# EAGLE design Pinduino-Nano-Sys11a-AR (EAGLE 9.0.1)
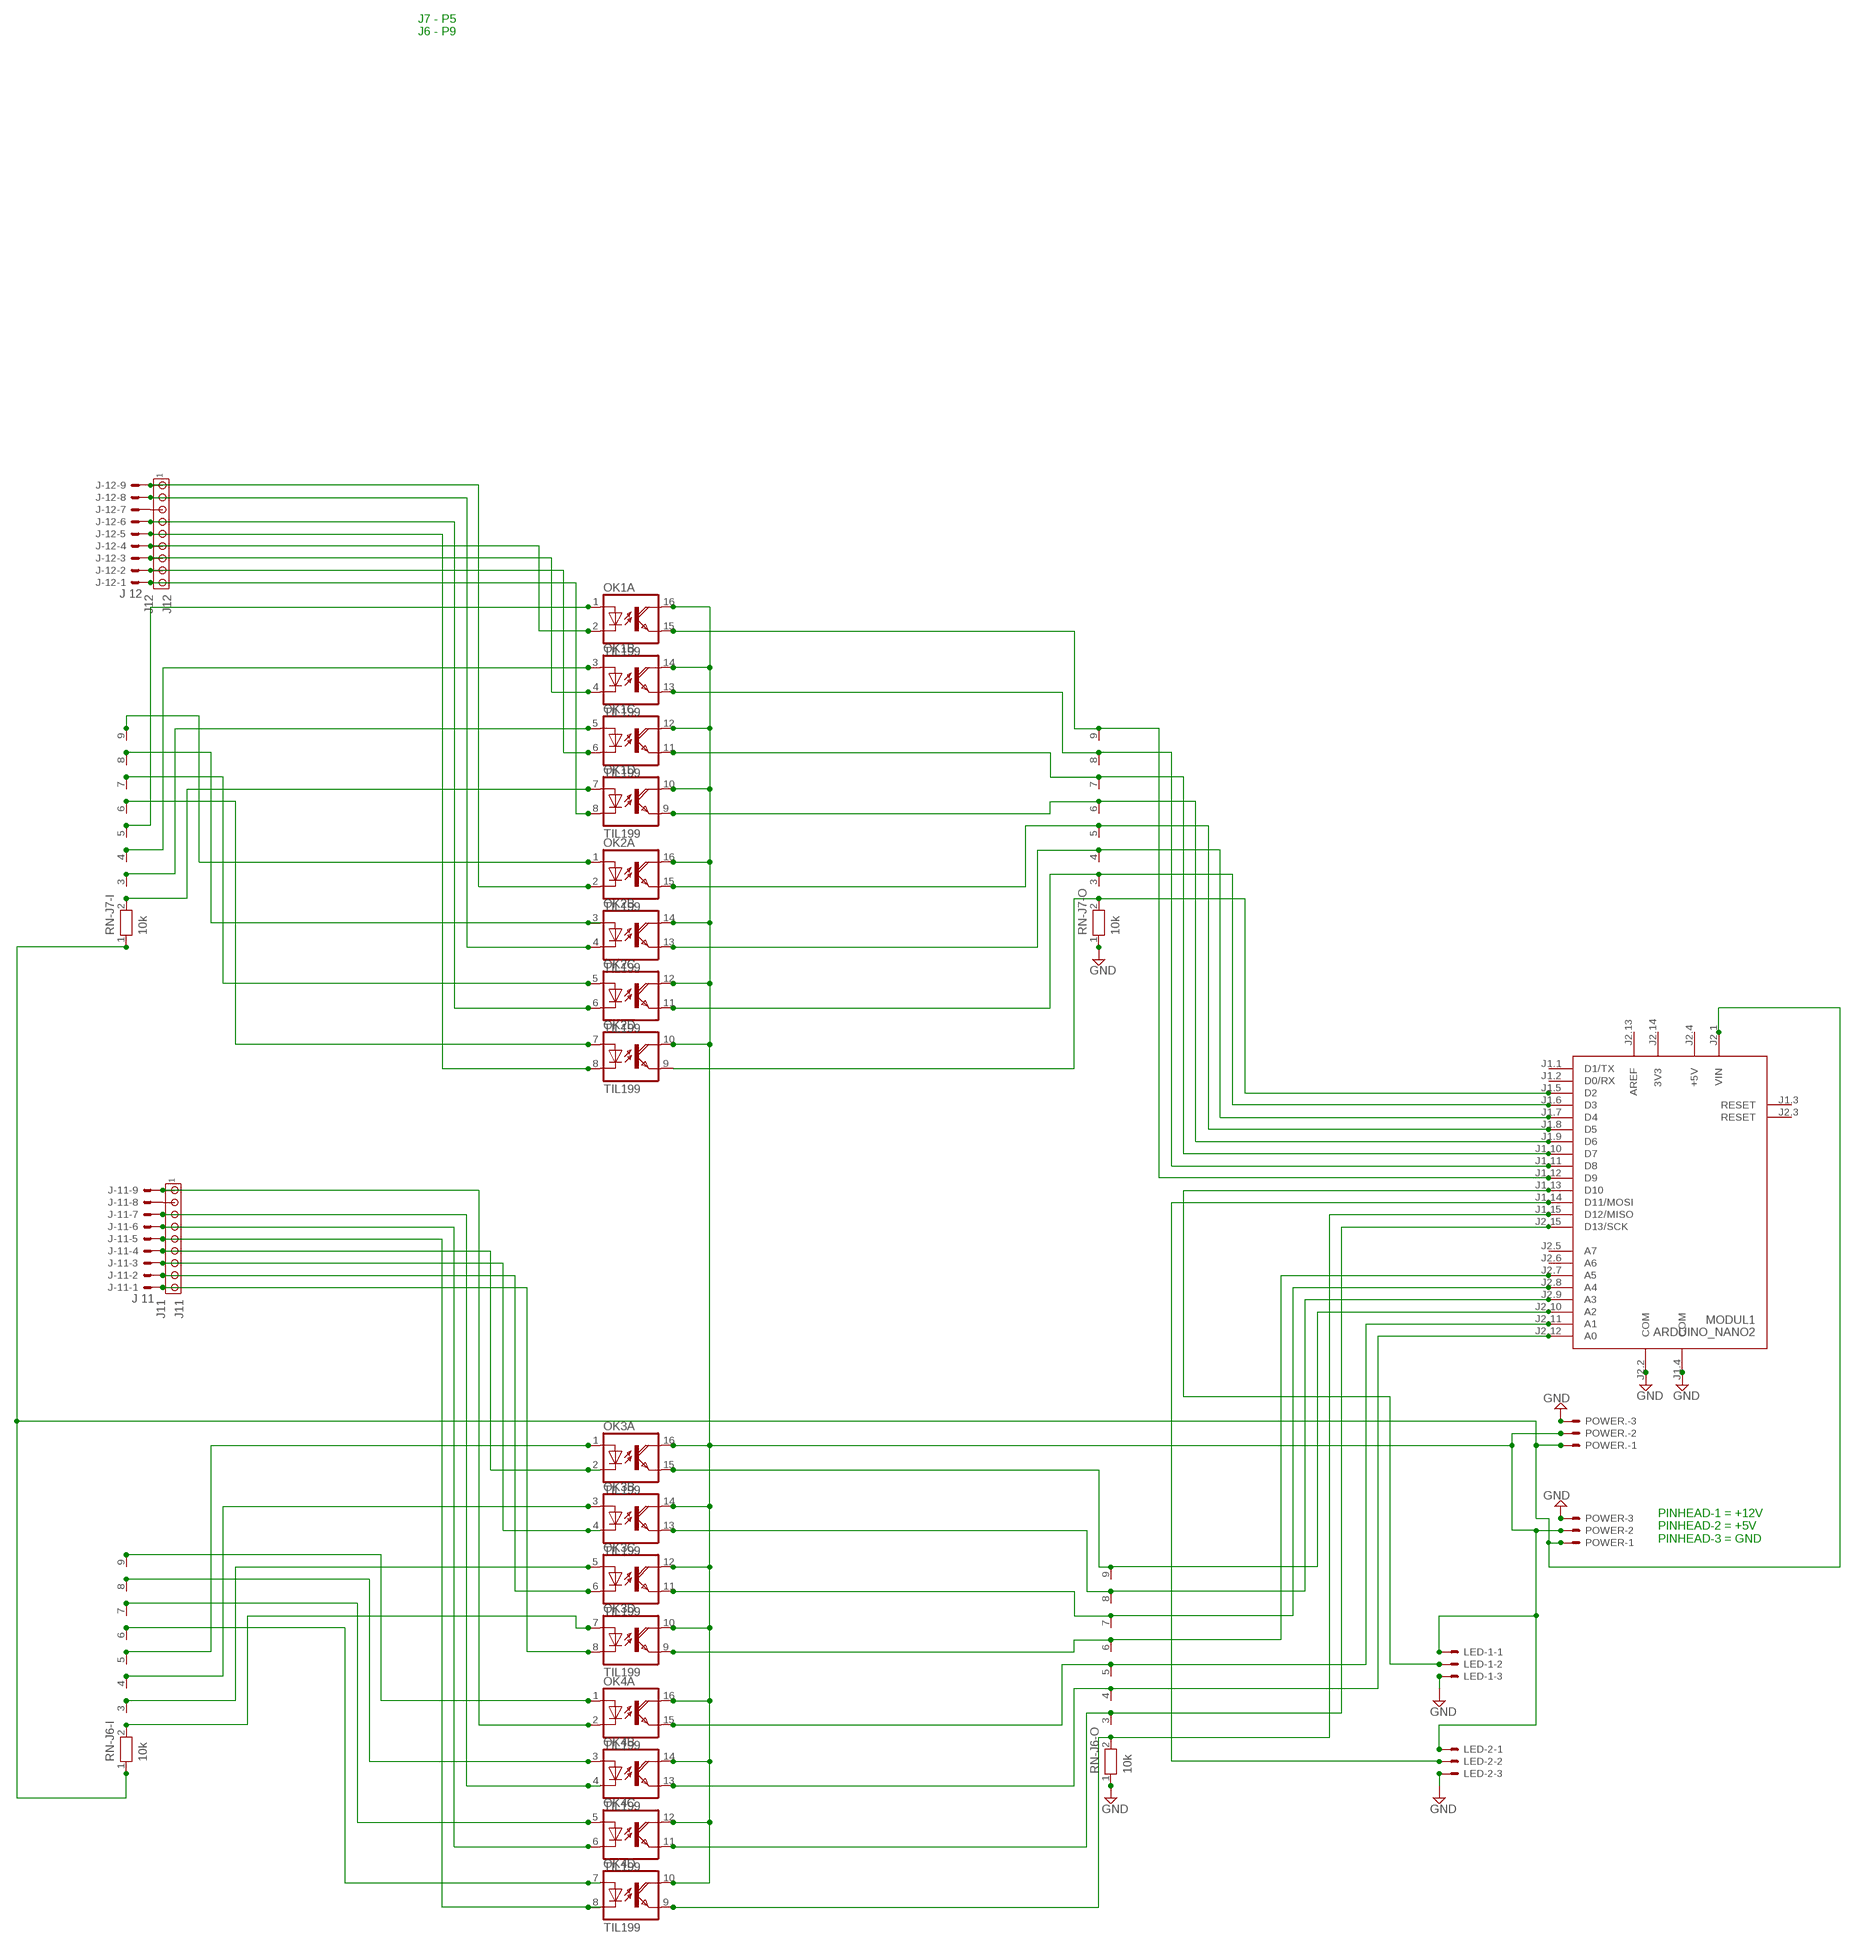
[diagram p0: schematic, sheet 1]

## Parts
J11  J11  MTA09-156  [1X9MTA]
J12  J12  MTA09-156  [1X9MTA]
J-11  J 11  KK-156-9  [KK-156-9]
J-12  J 12  KK-156-9  [KK-156-9]
LED-1  22-23-2031  [22-23-2031]
LED-2  22-23-2031  [22-23-2031]
MODUL1  ARDUINO_NANO2  [ARDUINO_NANO2]
OK1  TIL199  [DIL16]
OK2  TIL199  [DIL16]
OK3  TIL199  [DIL16]
OK4  TIL199  [DIL16]
POWER  22-23-2031  [22-23-2031]
POWER.  22-23-2031  [22-23-2031]
RN-J6-I  10k  RN08  [RN-9]
RN-J6-O  10k  RN08  [RN-9]
RN-J7-I  10k  RN08  [RN-9]
RN-J7-O  10k  RN08  [RN-9]

## Nets
ARD+5V [Power]: LED-1.1 LED-2.1 OK1.10(D:COL) OK1.12(C:COL) OK1.14(B:COL) OK1.16(A:COL) OK2.10(D:COL) OK2.12(C:COL) OK2.14(B:COL) OK2.16(A:COL) OK3.10(D:COL) OK3.12(C:COL) OK3.14(B:COL) OK3.16(A:COL) OK4.10(D:COL) OK4.12(C:COL) OK4.14(B:COL) OK4.16(A:COL) POWER.2 POWER..2
GND: LED-1.3 LED-2.3 MODUL1.J1.4(COM) MODUL1.J2.2(COM) POWER.3 POWER..3 RN-J6-O.1 RN-J7-O.1
N$1: J12.6 J-12.4 OK1.2(A:C)
N$2: MODUL1.J1.5(D2) OK2.9(D:EMI) RN-J7-O.2
N$3: OK1.3(B:A) RN-J7-I.4
N$4: OK1.5(C:A) RN-J7-I.3
N$5: OK1.7(D:A) RN-J7-I.2
N$6: OK2.1(A:A) RN-J7-I.9
N$7: OK2.3(B:A) RN-J7-I.8
N$8: OK2.5(C:A) RN-J7-I.7
N$9: OK1.1(A:A) RN-J7-I.5
N$10: J12.9 J-12.1 OK1.8(D:C)
N$11: J12.8 J-12.2 OK1.6(C:C)
N$12: J12.7 J-12.3 OK1.4(B:C)
N$13: OK2.7(D:A) RN-J7-I.6
N$14: J12.5 J-12.5 OK2.8(D:C)
N$15: J11.9 J-11.1 OK3.8(D:C)
N$16: J12.2 J-12.8 OK2.4(B:C)
N$17: J12.1 J-12.9 OK2.2(A:C)
N$18: MODUL1.J1.6(D3) OK2.11(C:EMI) RN-J7-O.3
N$19: J11.7 J-11.3 OK3.4(B:C)
N$20: J11.5 J-11.5 OK4.8(D:C)
N$21: J11.4 J-11.6 OK4.6(C:C)
N$22: J11.3 J-11.7 OK4.4(B:C)
N$23: J12.3 J-12.7
N$24: MODUL1.J1.11(D8) OK1.13(B:EMI) RN-J7-O.8
N$25: J11.2 J-11.8
N$27: J11.1 J-11.9 OK4.2(A:C)
N$28: MODUL1.J1.7(D4) OK2.13(B:EMI) RN-J7-O.4
N$29: OK4.1(A:A) RN-J6-I.9
N$30: OK4.3(B:A) RN-J6-I.8
N$31: OK4.5(C:A) RN-J6-I.7
N$32: OK3.3(B:A) RN-J6-I.4
N$33: OK3.1(A:A) RN-J6-I.5
N$34: OK3.5(C:A) RN-J6-I.3
N$35: OK4.7(D:A) RN-J6-I.6
N$36: MODUL1.J2.8(A4) OK3.11(C:EMI) RN-J6-O.7
N$37: OK3.7(D:A) RN-J6-I.2
N$38: MODUL1.J2.7(A5) OK3.9(D:EMI) RN-J6-O.6
N$39: MODUL1.J2.15(D13/SCK) OK4.11(C:EMI) RN-J6-O.3
N$40: J11.8 J-11.2 OK3.6(C:C)
N$42: MODUL1.J2.12(A0) OK4.13(B:EMI) RN-J6-O.4
N$43: MODUL1.J2.11(A1) OK4.15(A:EMI) RN-J6-O.5
N$44: LED-2.2 MODUL1.J1.14(D11/MOSI)
N$45: LED-1.2 MODUL1.J1.13(D10)
N$46: MODUL1.J1.12(D9) OK1.15(A:EMI) RN-J7-O.9
N$47: J12.4 J-12.6 OK2.6(C:C)
N$48: J11.6 J-11.4 OK3.2(A:C)
N$49: MODUL1.J1.10(D7) OK1.11(C:EMI) RN-J7-O.7
N$51: MODUL1.J1.8(D5) OK2.15(A:EMI) RN-J7-O.5
N$54: MODUL1.J1.9(D6) OK1.9(D:EMI) RN-J7-O.6
N$55: MODUL1.J2.9(A3) OK3.13(B:EMI) RN-J6-O.8
N$56: MODUL1.J2.10(A2) OK3.15(A:EMI) RN-J6-O.9
N$60: MODUL1.J1.15(D12/MISO) OK4.9(D:EMI) RN-J6-O.2
N$61 [GND]: MODUL1.J2.1(VIN) POWER.1 POWER..1 RN-J6-I.1 RN-J7-I.1
Unconnected: MODUL1.J1.1(D1/TX) MODUL1.J1.2(D0/RX) MODUL1.J1.3(RESET) MODUL1.J2.3(RESET) MODUL1.J2.5(A7) MODUL1.J2.6(A6)

## Notes on the sheet
- J7 - P5
  J6 - P9
- PINHEAD-1 = +12V
  PINHEAD-2 = +5V
  PINHEAD-3 = GND

## Power pins joined to a net without a drawn wire
3V3: MODUL1.J2.14(3V3)
+5V: MODUL1.J2.4(+5V)
AREF: MODUL1.J2.13(AREF)

## Library data of the parts
J11 J12 = con-amp:MTA09-156: AMP connector
J-11 J-12 = con-molex:KK-156-9: KK 156 HEADER Source: http://www.molex.com/pdm_docs/sd/026604100_sd.pdf; OC_FARNELL: unknown; OC_NEWARK: unknown
LED-1 LED-2 POWER POWER. = con-molex:22-23-2031: .100" (2.54mm) Center Header - 3 Pin; MF: MOLEX; MPN: 22-23-2031; OC_FARNELL: 1462950; OC_NEWARK: 30C0862
MODUL1 = arduino:ARDUINO_NANO2: Arduino Nano2 Auto generated by modulcreator.ulp \;; ANZAHL: 2; MODUL: TRUE; STECKX0: -76200; STECKX1: 76200; STECKY0: 177800; STECKY1: 177800
OK1-OK4 = optocoupler:TIL199: TEXAS INSTRUMENTS OPTO COUPLER; MPN: TIL 199; OC_FARNELL: 1683370; OC_NEWARK: 05R6483
RN-J6-I RN-J6-O RN-J7-I RN-J7-O = resistor-net:RN08: RESISTOR NETWORK; OC_FARNELL: unknown; OC_NEWARK: unknown

## Net classes
0 default: width 0.406 mm
1 Power: width 0.61 mm
2 GND: width 0.61 mm

## Board
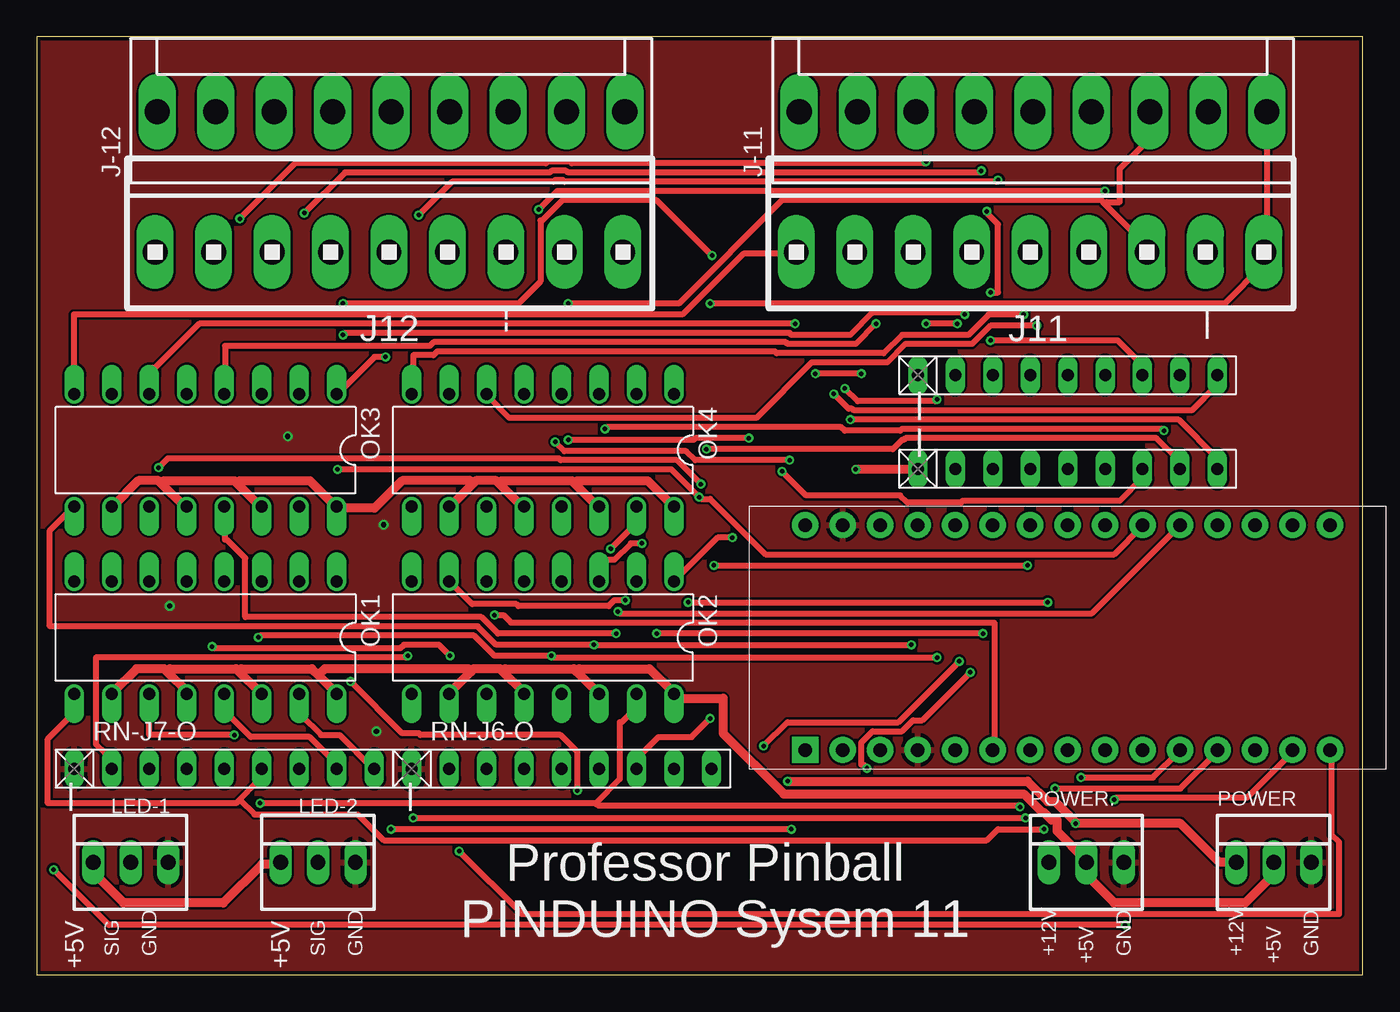
[diagram p1: board, top side]
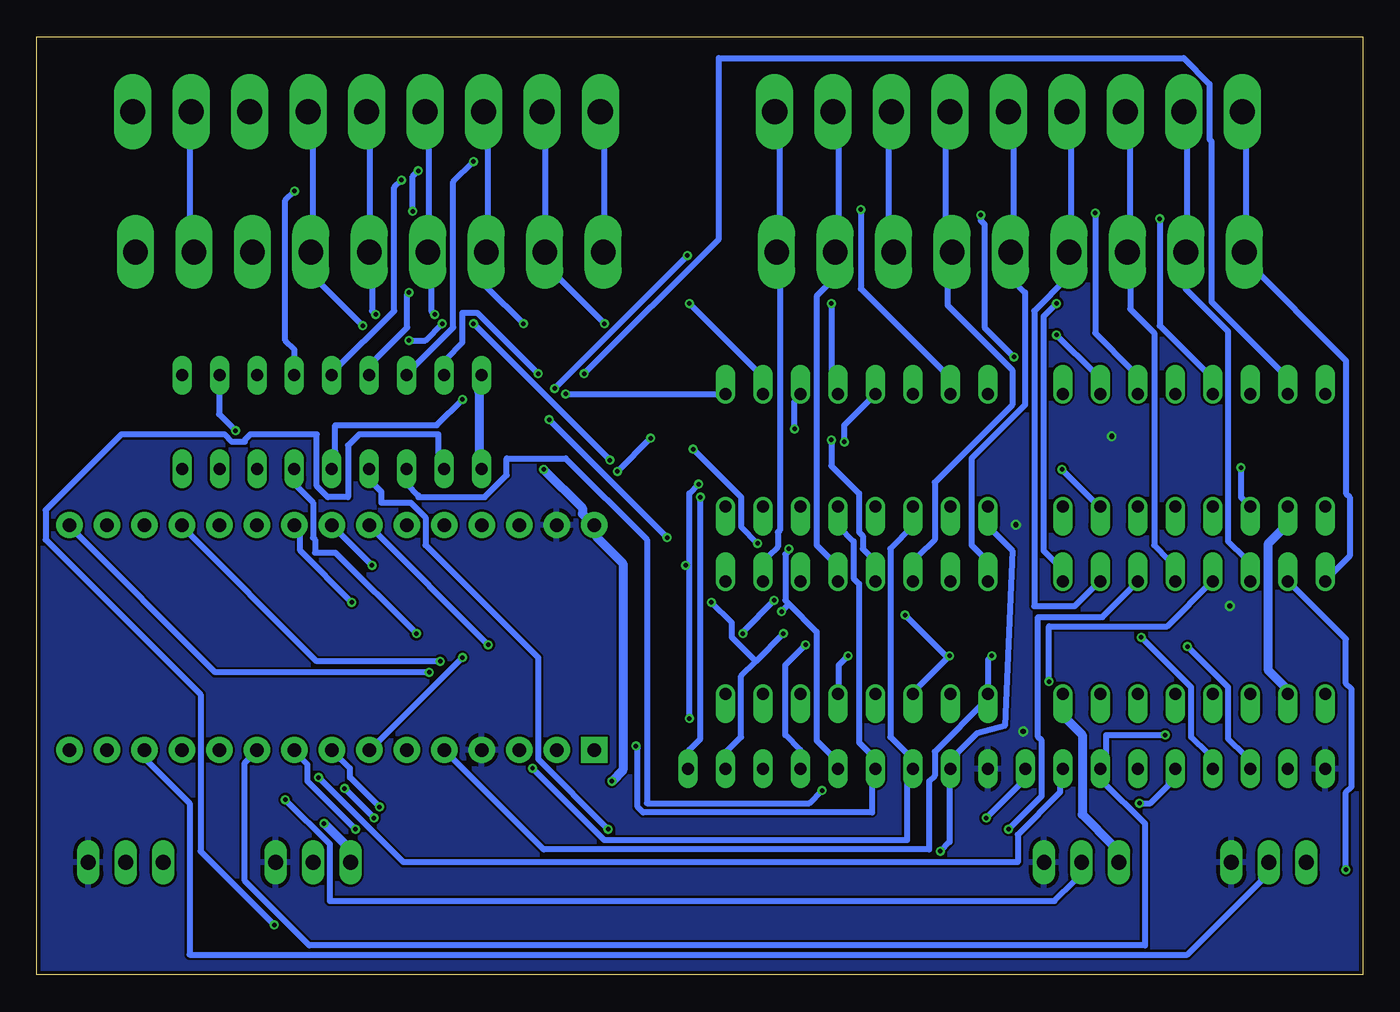
[diagram p2: board, bottom side, seen from below]

Size 89.84 x 63.57 mm. Coordinates in mm from the lower left corner, seen from the top.
Outline: 0,0 89.84,0 89.84,63.57 0,63.57 0,0
Copper layers (1*16): Top 0.035mm / dielectric 1.5mm / Bottom 0.035mm
Design rules "SeeedStudio_2layer_DRU_no_angle_20140221": minimum track width 6mil, minimum drill 12mil, track to track 6mil, track to pad 6mil, pad to pad 6mil, via to via 6mil, smd to smd 0mil, copper to edge 10mil, drill to drill 10mil, minimum pad ring 10mil, minimum via ring 6mil, stop-mask expansion 2mil, vias tented up to drill 100mil, thermal gap 10mil

### Footprints (pad centres in the part's own frame; a part is rotated, then mirrored left to right if it is on the bottom)
1X9MTA = drill 1.676 long: 1 15.85,0; 2 11.887,0; 3 7.925,0; 4 3.962,0; 5 0,0; 6 -3.962,0; 7 -7.925,0; 8 -11.887,0; 9 -15.85,0
KK-156-9 = drill 1.7 pad 2.184 long: 1 -15.84,0; 2 -11.88,0; 3 -7.92,0; 4 -3.96,0; 5 0,0; 6 3.96,0; 7 7.92,0; 8 11.88,0; 9 15.84,0
22-23-2031 = drill 1 long: 1 -2.54,0; 2 0,0; 3 2.54,0
ARDUINO_NANO2 = drill 0.914 pad 1.778 square: J1.1 -7.62,17.78 | drill 0.914 pad 1.778: J1.2 -7.62,15.24; J1.3 -7.62,12.7; J1.4 -7.62,10.16; J1.5 -7.62,7.62; J1.6 -7.62,5.08; J1.7 -7.62,2.54; J1.8 -7.62,0; J1.9 -7.62,-2.54; J1.10 -7.62,-5.08; J1.11 -7.62,-7.62; J1.12 -7.62,-10.16; J1.13 -7.62,-12.7; J1.14 -7.62,-15.24; J1.15 -7.62,-17.78; J2.1 7.62,17.78; J2.2 7.62,15.24; J2.3 7.62,12.7; J2.4 7.62,10.16; J2.5 7.62,7.62; J2.6 7.62,5.08; J2.7 7.62,2.54; J2.8 7.62,0; J2.9 7.62,-2.54; J2.10 7.62,-5.08; J2.11 7.62,-7.62; J2.12 7.62,-10.16; J2.13 7.62,-12.7; J2.14 7.62,-15.24; J2.15 7.62,-17.78
DIL16 = drill 0.813 offset: 1 -8.89,-3.81; 2 -6.35,-3.81; 3 -3.81,-3.81; 4 -1.27,-3.81; 5 1.27,-3.81; 6 3.81,-3.81; 7 6.35,-3.81; 8 8.89,-3.81; 9 8.89,3.81; 10 6.35,3.81; 11 3.81,3.81; 12 1.27,3.81; 13 -1.27,3.81; 14 -3.81,3.81; 15 -6.35,3.81; 16 -8.89,3.81
RN-9 = drill 0.813 long: 1 -10.16,0; 2 -7.62,0; 3 -5.08,0; 4 -2.54,0; 5 0,0; 6 2.54,0; 7 5.08,0; 8 7.62,0; 9 10.16,0

### Placement (x,y rotation side)
J11  67.31,48.99 0 top
J12  23.86,48.99 0 top
J-11  67.5,58.5 0 top
J-12  24,58.5 0 top
LED-1  6.35,7.62 0 top
LED-2  19.05,7.62 0 top
MODUL1  69.85,22.86 90 top
OK1  11.43,22.86 180 top
OK2  34.29,22.86 180 top
OK3  11.43,35.56 180 top
OK4  34.29,35.56 180 top
POWER  83.82,7.62 0 top
POWER.  71.12,7.62 0 top
RN-J6-I  69.85,40.64 0 top
RN-J6-O  35.56,13.97 0 top
RN-J7-I  69.85,34.29 0 top
RN-J7-O  12.7,13.97 0 top

### Tracks (layer width: path | path; a pad name or v marks a point on that pad's centre or on a via)
ARD+5V
  Top 0.61: 8.44,33.31 10,31.75 OK3.12 | 8.44,33.31 8.25,33.5 6.88,33.5 5.12,31.75 OK3.10 | 13.56,33.31 13.38,33.5 8.62,33.5 8.44,33.31 | 13.56,33.31 15.12,31.75 OK3.14 | 13.56,33.31 13.75,33.5 18.5,33.5 20.25,31.75 OK3.16 20.5,31.62 22.88,31.62 24.75,33.5 29.38,33.5 29.56,33.31 | 29.56,33.31 29.75,33.5 31.12,33.5 31.31,33.31 | 29.56,33.31 28,31.75 OK4.10 | 31.31,33.31 32.88,31.75 OK4.12 | 36.44,33.31 36.25,33.5 31.5,33.5 31.31,33.31 | 36.44,33.31 38,31.75 OK4.14 | OK4.16 43.12,31.75 41.38,33.5 36.62,33.5 36.44,33.31 | LED-1.1 3.88,7.5 3.88,6.5 4.25,6.5 5.88,4.88 12.62,4.88 15.25,7.5 16.5,7.5 LED-2.1 | 8.81,20.56 10.25,19.12 OK1.12 | 8.81,20.56 8.62,20.75 6.75,20.75 5.12,19.12 OK1.10 | 13.69,20.56 13.5,20.75 9,20.75 8.81,20.56 | 13.69,20.56 15.12,19.12 OK1.14 | 19.06,20.31 18.62,20.75 13.88,20.75 13.69,20.56 | 19.06,20.31 20.25,19.12 OK1.16 | POWER.2 83.75,7.5 83.75,6.75 81.88,4.88 73,4.88 71.38,6.5 71.12,6.5 71.12,7.5 POWER..2 71,7.88 69.12,9.75 69.12,10.5 68.75,10.5 68.25,11 68.12,11 66.88,12.25 50.62,12.25 46.5,16.38 46.5,18.75 43.25,18.75 OK2.16 43.12,19.12 41.5,20.75 36.75,20.75 36.56,20.56 | 29.44,20.56 29.62,20.75 31.38,20.75 31.56,20.56 | 29.44,20.56 28,19.12 OK2.10 | 31.56,20.56 33,19.12 OK2.12 | 36.56,20.56 36.38,20.75 31.75,20.75 31.56,20.56 | 36.56,20.56 38,19.12 OK2.14 | 19.06,20.31 19.5,20.75 29.25,20.75 29.44,20.56
  Bottom 0.61: LED-2.1 16.62,7.62 16.88,7.88 16.88,8.75 19,10.88 19,16.25 20.25,17.5 20.25,19 OK1.16 | OK3.10 5.12,31.75 5.38,31.5 5.38,30.25 6.38,29.25 6.38,20.62 5.12,19.38 5.12,19.12 OK1.10
GND  (via drill 0.35)
  other vias: 23,16.5 23.5,30.5 17,36.5 9,25
  pour Top: -1.27,64.77 -1.27,-2.54 92.71,-2.54 92.71,64.77
  pour Bottom: -2.54,66.04 -2.54,-1.27 91.44,-1.27 91.44,66.04
N$1
  Bottom 0.406: OK1.2 17.88,26.62 19.5,25 22.25,25 22.25,45 20,47.25 20,48.88 J12.6 19.75,49.12 19.75,58.25 20,58.5 J-12.4
N$2  (via drill 0.3)
  Top 0.406: v25.12,21.62 25,21.5 4,21.5 4,15.62 4.62,15 5,15 5,14 RN-J7-O.2
  Bottom 0.406: v25.12,21.62 25.38,21.38 25.38,19.12 OK2.9 25.5,18.88 25.5,18.62 29,15.12 29,13.5 29.38,13.12 29.38,8.5 55.5,8.5 62.12,15.12 MODUL1.J1.5
N$3  (via drill 0.3)
  Top 0.406: v51.12,9.88 v24,9.88
  Bottom 0.406: v24,9.88 21.75,12.12 21.75,15.88 22,16.12 22,24.25 17.62,24.25 15.25,26.62 OK1.3 | v51.12,9.88 55.88,14.62 55.88,21.5 63.5,29.12 63.5,31 64.5,32 66.5,32 66.5,32.75 67.25,33.5 67.25,34.25 RN-J7-I.4
N$4  (via drill 0.3)
  Top 0.406: v21.25,19.88 24.75,16.38 25.88,16.38 26,16.25 35.5,16.25 36.62,15.12 v36.62,12.5
  Bottom 0.406: v21.25,19.88 21.25,23.62 13.25,23.62 10.25,26.62 OK1.5 | v36.62,12.5 37.5,11.62 48.5,11.62 48.5,29.5 54,35 58,35 58,33.88 59.5,32.38 64,32.38 64,32.5 64.75,33.25 64.75,34.25 RN-J7-I.3
N$5  (via drill 0.3)
  Top 0.406: v1.12,7.12 4.88,3.38 v73.75,3.38
  Bottom 0.406: v1.12,7.12 1.12,12.38 0.75,12.75 0.75,19.38 1.12,19.75 1.12,22.75 5,26.62 OK1.7 | v73.75,3.38 78.75,8.38 78.75,19 89.25,29.5 89.25,31.5 84.12,36.62 77.12,36.62 76.62,36.12 75.75,36.12 75.75,36.25 75.38,36.62 70.88,36.62 70.88,33.12 70.12,32.38 68.75,32.38 68.75,35.88 68,36.62 62.62,36.62 62.62,35.38 62.25,35 62.25,34.38 RN-J7-I.2
N$6  (via drill 0.3)
  Top 0.406: v47.12,29.62 46.12,29.62 43.25,26.75 OK2.1 | v55.12,37.62 77.38,37.62 80,35 80,34.38 RN-J7-I.9
  Bottom 0.406: v55.12,37.62 v47.12,29.62
N$7  (via drill 0.3)
  Top 0.406: v41,29.25 40.25,29.25 39.12,28.12 38.12,28.12 38.12,26.75 OK2.3 | v45.38,35.62 58,35.62 58.62,36.25 58.75,36.25 58.88,36.38 75.88,36.38 77.38,34.88 77.38,34.38 RN-J7-I.8
  Bottom 0.406: v41,29.25 42.12,30.38 42.12,32.38 v45.38,35.62
N$8  (via drill 0.3)
  Top 0.406: v36,36.25 44.5,36.25 44.62,36.38 v48.25,36.38 | v50.5,34.12 52.12,32.5 58.5,32.5 59,32 62.62,32 62.75,32.12 73.38,32.12 74.88,33.62 74.88,34.25 RN-J7-I.7
  Bottom 0.406: v36,36.25 36,34.5 34.12,32.62 34.12,30 33.88,29.75 33.88,28.88 33.38,28.38 33.38,27 33.12,26.75 OK2.5 | v50.5,34.12 v48.25,36.38
N$9  (via drill 0.3)
  Top 0.406: v20.75,45.5 32.62,45.5 34.12,47 34.12,51.12 34.25,51.12 35.62,52.5 42,52.5 v45.75,48.75 | v54.75,39.75 55.62,38.88 60.88,38.88 v61,39
  Bottom 0.406: v20.75,45.5 21.62,44.62 21.62,28.75 20.75,27.88 20.75,27.12 20.38,26.75 OK1.1 | v54.75,39.75 v45.75,48.75 | v61,39 62.75,37.25 69.62,37.25 69.62,35.5 69.75,35.38 69.75,34.38 RN-J7-I.5
N$10
  Bottom 0.406: OK1.8 2.5,26.75 0.88,28.38 0.88,32.38 1.12,32.62 1.12,41.62 8,48.5 8,48.88 J12.9 7.88,49.12 7.88,58.25 8.12,58.5 J-12.1
N$11
  Bottom 0.406: OK1.6 7.62,26.75 8,27.12 8,28.25 9.12,29.38 9.12,43.62 12,46.5 12,48.88 J12.8 11.88,49.12 11.88,58.38 12,58.5 J-12.2
N$12
  Bottom 0.406: OK1.4 12.75,26.75 13.12,27.12 13.12,28.12 14.12,29.12 14.12,43.5 15.75,45.12 15.75,48.75 15.88,48.88 J12.7 15.75,49 15.75,58.25 16,58.5 J-12.3
N$13  (via drill 0.3)
  Top 0.406: v39.88,25.38 39.12,25.38 38.75,25 32.62,25 32.5,25.12 29.5,25.12 28,26.62 OK2.7 | v64.12,23.12 v42,23.12
  Bottom 0.406: v39.88,25.38 42,23.25 v42,23.12 | v64.12,23.12 69.62,28.62 71,28.62 71,29.5 71.12,29.62 71.12,32 72.38,33.25 72.38,34.25 RN-J7-I.6
N$14
  Bottom 0.406: OK2.8 25.5,26.75 25.75,27 25.75,28.38 26.5,29.12 26.5,35 22.88,38.62 22.88,46.25 23.75,47.12 23.75,48.88 J12.5 23.62,49 23.62,58.12 J-12.5
N$15
  Top 0.406: OK3.8 2.5,39.38 2.5,44.75 43.75,44.75 47.88,48.88 51.38,48.88 J11.9
  Bottom 0.406: J-11.1 51.62,58.5 51.38,58.25 51.38,49 J11.9
N$16
  Bottom 0.406: OK2.4 35.62,26.75 36,27.12 36,28.12 37,29.12 37,46 35.75,47.25 35.75,48.88 J12.2 35.62,49.12 35.5,49.25 35.5,58.12 J-12.8
N$17
  Bottom 0.406: OK2.2 40.62,26.75 40.25,27.12 40.25,28.38 39.62,29 39.62,30 39.5,30.12 39.5,48.75 39.62,48.88 J12.1 39.5,49 39.5,58.25 39.75,58.5 J-12.9
N$18  (via drill 0.3)
  Top 0.406: v11.88,22.25 12,22.12 24.62,22.12 24.88,22.38 27.25,22.38 v28,21.62 | v31,24.38 31.62,24.38 32.12,23.88 64.88,23.88 64.88,15.25 MODUL1.J1.6
  Bottom 0.406: v11.88,22.25 9.12,19.5 9.12,16 8,14.88 8,14.38 7.62,14 RN-J7-O.3 | OK2.11 30.38,19.12 30.38,19.25 v28,21.62 28.25,21.62 v31,24.38
N$19  (via drill 0.3)
  Top 0.406: v56.88,44.12 55.5,42.75 50.88,42.75 50.75,42.88 26.88,42.88 26.62,42.62 12.75,42.62 12.75,39.38 OK3.4
  Bottom 0.406: v56.88,44.12 59.38,46.62 59.38,48.88 J11.7 59.25,49.12 59.25,58.25 59.5,58.5 J-11.3
N$20  (via drill 0.3)
  Top 0.406: v66.88,44.75 64.5,44.75 63.12,43.38 58.62,43.38 57.38,42.12 50.12,42.12 50,42.25 27.12,42.25 26.88,42 25.5,42 25.5,39.38 OK4.8
  Bottom 0.406: v66.88,44.75 67.12,45 67.12,48.75 67.25,48.88 J11.5 67.25,49.12 67.25,58.25 J-11.5
N$21  (via drill 0.3)
  Top 0.406: v67.75,44 64.62,44 63.38,42.75 58.88,42.75 57.62,41.5 52.5,41.5 48.75,37.75 32,37.75 30.5,39.25 OK4.6
  Bottom 0.406: v67.75,44 71.25,47.5 71.25,48.88 J11.4 71.12,49.12 71.12,58.25 71.38,58.5 J-11.6
N$22  (via drill 0.3)
  Top 0.406: v36,45.5 43.5,45.5 50.5,52.5 72.12,52.5 72.38,52.25 | 72.38,52.25 75.12,49.5 75.12,49 J11.3 | J-11.7 75.38,58.5 75.38,56.25 75,56.25 73.38,54.62 73.38,52.38 72.5,52.38 72.38,52.25
  Bottom 0.406: v36,45.5 36,39.75 35.62,39.38 OK4.4
N$23
  Bottom 0.406: J12.3 31.88,49 32.12,49.25 32.12,58.38 32,58.5 J-12.7
N$24  (via drill 0.3)
  Top 0.406: OK1.13 12.75,19 12.75,17.38 13.25,17.38 14.5,16.12 18.5,16.12 20.25,14.38 20.25,14 RN-J7-O.8 | v70.75,13.38 75.62,13.38 77.38,15.12 MODUL1.J1.11
  Bottom 0.406: v70.75,13.38 65,7.62 23.38,7.62 23.38,9.5 20.5,12.38 20.5,12.75 20.38,12.88 20.38,13.88 RN-J7-O.8
N$25
  Bottom 0.406: J11.2 79.25,49 79.5,49.25 79.5,58.5 J-11.8
N$27  (via drill 0.3)
  Top 0.406: v45.62,45.5 80.5,45.5 83.12,48.12 83.12,48.88 J11.1 83.25,49.12 83.38,49.12 83.38,58.5 J-11.9
  Bottom 0.406: v45.62,45.5 41,40.88 41,39.62 40.75,39.38 OK4.2
N$28  (via drill 0.3)
  Top 0.406: v15,22.88 15.12,23 29.62,23 31,21.62 v34.88,21.62 35,21.5 v61,21.5
  Bottom 0.406: v15,22.88 11.62,19.5 11.62,16.12 10.5,15 10.5,14.25 10.25,14 RN-J7-O.4 | v34.88,21.62 35.5,21 35.5,19.12 OK2.13 | v61,21.5 67.25,15.25 MODUL1.J1.7
N$29  (via drill 0.3)
  Top 0.406: v54,39.38 55,38.38 55.25,38.38 55.38,38.25 78.25,38.25 80,40 80,40.62 RN-J6-I.9
  Bottom 0.406: v54,39.38 43.25,39.38 OK4.1
N$30  (via drill 0.3)
  Top 0.406: v38.5,37 38.62,37.12 54.5,37.12 54.75,36.88 58.5,36.88 58.62,37 76.25,37 v76.38,36.88
  Bottom 0.406: v38.5,37 38.5,38.88 38.12,39.25 OK4.3 | v76.38,36.88 77.5,38 77.5,40.62 RN-J6-I.8
N$31  (via drill 0.3)
  Top 0.406: v35.12,36.12 35.75,35.5 44,35.5 44.62,34.88 v51,34.88 | v62.38,44.12 v60.25,44.12 | v64.62,43 73.25,43 74.88,41.38 74.88,40.75 RN-J6-I.7
  Bottom 0.406: v35.12,36.12 35.12,37.25 33.12,39.25 OK4.5 | v60.25,44.12 v51,34.88 | v62.38,44.12 63.5,43 v64.62,43
N$32  (via drill 0.3)
  Top 0.406: v18.12,51.62 20.88,54.38 34.75,54.38 34.88,54.5 35.88,54.5 36,54.38 63.88,54.38 v64,54.5 | v64.38,51.75 64.38,51.62 65.12,50.88 65.12,46.25 v64.62,46.25
  Bottom 0.406: v18.12,51.62 18.12,43.5 15.62,41 15.62,39.75 OK3.3 | v64,54.5 64.38,54.12 v64.38,51.75 | v64.62,46.25 64.75,46.12 64.75,43.88 67.25,41.38 67.25,40.75 RN-J6-I.4
N$33  (via drill 0.3)
  Top 0.406: v23.62,41.88 22.88,41.88 20.38,39.38 OK3.1 | v25.88,51.5 28.12,53.75 35,53.75 35.12,53.88 35.62,53.88 35.75,53.75 65,53.75 v65.12,53.88
  Bottom 0.406: v23.62,41.88 25.62,43.88 25.62,50.88 25.88,51.12 v25.88,51.5 | v65.12,53.88 65.62,53.38 65.62,45 69.75,40.88 69.75,40.75 RN-J6-I.5
N$34  (via drill 0.3)
  Top 0.406: v13.75,51.25 17.5,55 34.5,55 34.62,55.12 36.12,55.12 36.25,55 60.12,55 v60.25,55.12
  Bottom 0.406: v13.75,51.25 13.75,44 10.5,40.75 10.5,39.62 10.25,39.38 OK3.5 | v60.25,55.12 61.62,53.75 61.62,43.88 64.75,40.75 RN-J6-I.3
N$35  (via drill 0.3)
  Top 0.406: v34,51.88 35.25,53.12 v72.38,53.12
  Bottom 0.406: v34,51.88 34,46.5 28.38,40.88 28.38,39.75 28,39.38 OK4.7 | v72.38,53.12 73,52.5 73,43 72.38,42.38 72.38,40.75 RN-J6-I.6
N$36  (via drill 0.3)
  Top 0.406: v8.25,34.38 8.88,35 35.38,35 35.5,34.88 43.38,34.88 v45,33.25 | v45.62,17.38 44.38,16.12 42.12,16.12 40.75,14.75 40.75,14 RN-J6-O.7 | v45.88,27.75 v67.12,27.75
  Bottom 0.406: v8.25,34.38 8.25,32.38 OK3.11 | v45,33.25 45.62,32.62 45.62,27.75 | v45.62,17.38 45.62,27.75 | v67.12,27.75 69.75,30.38 MODUL1.J2.8 | v45.88,27.75 45.62,27.75
N$37  (via drill 0.3)
  Top 0.406: v55.88,40.75 v52.75,40.75
  Bottom 0.406: v52.75,40.75 43.62,49.88 43.62,62.12 12.12,62.12 10.38,60.38 10.38,56.62 10.25,56.5 10.25,45.62 5.5,40.88 5.5,39.75 5.12,39.38 OK3.7 | v55.88,40.75 60,44.88 61,44.88 61,42.88 62.12,41.75 62.12,40.75 RN-J6-I.2
N$38  (via drill 0.3)
  Top 0.406: OK3.9 2.5,31.75 0.88,30.12 0.88,23.62 29.88,23.62 31.12,22.38 v37.75,22.38 v59.25,22.38
  Bottom 0.406: v37.75,22.38 39.12,21 39.12,16.25 38.12,15.25 38.12,14 RN-J6-O.6 | v59.25,22.38 67.25,30.38 MODUL1.J2.7
N$39  (via drill 0.3)
  Top 0.406: v63.25,20.5 60,17.25 59.38,17.25 58.62,16.5 56.62,16.5 55.88,15.75 55.88,14.25 56,14.25 v56.25,14
  Bottom 0.406: OK4.11 30.5,31.75 30.5,30.38 32,28.88 32,16.12 30.88,15 30.88,14.38 30.5,14 RN-J6-O.3 30.88,14.12 30.88,9.12 51.38,9.12 v56.25,14 | v63.25,20.5 77.75,20.5 87.62,30.38 MODUL1.J2.15
N$40  (via drill 0.3)
  Top 0.406: v51.38,44.12 11,44.12 8,41.12 7.62,41.12 OK3.6
  Bottom 0.406: v51.38,44.12 55.38,48.12 55.38,48.88 J11.8 55.38,49.12 55.38,58.38 55.5,58.5 J-11.2
N$42  (via drill 0.3)
  Top 0.406: v62.5,21.25 58.38,17.12 50.88,17.12 v49.25,15.5
  Bottom 0.406: OK4.13 35.5,31.75 35.5,30.38 34.5,29.38 34.5,26.88 34.12,26.5 34.12,15.75 33.38,15 33.38,14.25 33.12,14 RN-J6-O.4 33.25,13.88 33.25,11 48.75,11 49.12,11.38 49.12,15.38 v49.25,15.5 | v62.5,21.25 70.88,21.25 80,30.38 MODUL1.J2.12
N$43  (via drill 0.3)
  Top 0.406: v38.88,28.88 40.62,30.62 40.62,31.75 OK4.15 | v39.38,24.62 39.5,24.5 71.5,24.5 77.38,30.38 MODUL1.J2.11
  Bottom 0.406: 38.88,25.12 39.12,25.38 39.12,28.5 38.88,28.75 v38.88,28.88 | 38.88,25.12 37,23.25 37,15.88 36,14.88 36,14.38 35.62,14 RN-J6-O.5 | 38.88,25.12 v39.38,24.62
N$44  (via drill 0.3)
  Top 0.406: v73,11.88 73.12,12 82,12 85.12,15.12 MODUL1.J1.14
  Bottom 0.406: v73,11.88 70,8.88 70,5 20.88,5 19.5,6.38 19.5,7.12 19.12,7.5 LED-2.2
N$45
  Bottom 0.406: LED-1.2 6.38,7.5 6.88,7 6.88,6.38 11.88,1.38 79.5,1.38 79.5,11.62 82.5,14.62 82.5,15.12 MODUL1.J1.13
N$46  (via drill 0.3)
  Top 0.406: RN-J7-O.9 22.75,14 20.5,16.25 19.25,16.25 17.88,17.62 17.88,19 OK1.15 | v69,12.62 77.5,12.62 80,15.12 MODUL1.J1.12 | v25.5,10.62 v67,10.62
  Bottom 0.406: v67,10.62 v69,12.62 | v25.5,10.62 22.88,13.25 22.88,13.88 RN-J7-O.9
N$47
  Bottom 0.406: OK2.6 30.38,26.75 30.12,27 30.12,28.38 29,29.5 29,33.38 23.75,38.62 23.75,41 28.12,45.38 28.12,48.62 27.88,48.88 J12.4 28.25,48.75 28.25,58.25 28,58.5 J-12.6
N$48  (via drill 0.3)
  Top 0.406: v20.75,43.38 20.88,43.5 51,43.5 51.12,43.38 55.12,43.38 56.62,44.88 62.75,44.88 v62.88,44.75
  Bottom 0.406: v20.75,43.38 18.12,40.75 18.12,39.62 17.88,39.38 OK3.2 | v62.88,44.75 63.12,45 63.12,48.75 63.25,48.88 J11.6 63.25,49.12 63.25,58.25 63.5,58.5 J-11.4
N$49  (via drill 0.3)
  Top 0.406: v13.38,16.25 7.62,16.25 7.62,19 OK1.11
  Bottom 0.406: v13.38,16.25 17.38,16.25 17.38,15 17.75,14.62 17.75,14 RN-J7-O.7 17.62,13.88 17.62,13.12 14.75,10.25 14.75,2 71.38,2 75.75,6.38 75.75,14.38 75,15.12 MODUL1.J1.10
N$51  (via drill 0.3)
  Top 0.406: 37.88,11.62 v15.12,11.62 | 37.88,11.62 39.5,13.25 39.5,17.12 39.62,17.12 40.62,18.12 40.62,19 OK2.15 | v66.62,11.38 66.5,11.5 38,11.5 37.88,11.62
  Bottom 0.406: v15.12,11.62 14.38,11.62 13.12,12.88 13.12,13.5 12.75,13.88 RN-J7-O.5 | v66.62,11.38 68.62,13.38 68.62,14 69.75,15.12 MODUL1.J1.8
N$54  (via drill 0.3)
  Top 0.406: 13.75,11.88 14.88,13 14.88,13.88 15.12,13.88 RN-J7-O.6 | 13.75,11.88 13.5,11.62 0.75,11.62 0.75,16 2.12,17.38 2.5,17.38 2.5,19 OK1.9 | v68.25,9.88 65.12,9.88 64.38,9.12 23.5,9.12 21.75,10.88 14.75,10.88 13.75,11.88
  Bottom 0.406: v68.25,9.88 71.5,13.12 71.5,14.25 72.38,15.12 MODUL1.J1.9
N$55  (via drill 0.3)
  Top 0.406: v39.25,23.12 31.25,23.12 30.12,24.25 14.12,24.25 14.12,28.25 12.88,29.5 12.75,29.5 12.75,31.75 OK3.13 | v44.12,25.25 v68.5,25.25
  Bottom 0.406: 41.12,21.25 42.12,20.25 42.12,16.12 43.12,15.12 43.12,14 RN-J6-O.8 | 41.12,21.25 v39.25,23.12 | v68.5,25.25 72,28.75 72,30 72.38,30.38 MODUL1.J2.9 | v44.12,25.25 42.75,23.88 42.75,22.88 41.12,21.25
N$56  (via drill 0.3)
  Top 0.406: v20.38,34.25 43,34.25 v44.88,32.38 45,32.25 45.62,32.25 49.38,28.5 73,28.5 74.88,30.38 MODUL1.J2.10
  Bottom 0.406: v20.38,34.25 17.88,31.75 OK3.15 | v44.88,32.38 44.88,16 45.62,15.25 45.62,14 RN-J6-O.9
N$60  (via drill 0.3)
  Top 0.406: v28.62,8.38 32.88,4.12 88.25,4.12 88.25,9 87.75,9.5 87.75,15.12 MODUL1.J1.15
  Bottom 0.406: OK4.9 25.38,31.75 25.38,30.38 23.75,28.75 24.25,16.88 26.12,16.38 27.5,15 27.5,14.38 27.88,14 RN-J6-O.2 28,13.88 28,9 v28.62,8.38
N$61  (via drill 0.3)
  Top 0.61: POWER.1 81.25,7.62 80.12,7.62 77.5,10.25 v70.38,10.25 70.25,10.5 69,11.75 68.5,11.75 67.12,13.12 v50.88,13.12 | v55.5,34.25 59.62,34.25 RN-J7-I.1
  Bottom 0.61: v70.38,10.25 69,8.88 69,8 68.62,7.62 POWER..1 | RN-J7-I.1 59.75,34.38 59.88,34.5 59.88,39.5 59.75,39.62 59.75,40.62 RN-J6-I.1 | v55.5,34.25 52.88,31.62 52.88,31.25 52.12,30.5 MODUL1.J2.1 51.88,30.25 51.88,29.62 50.12,27.88 50.12,13.88 v50.88,13.12

### Text on the board
tNames: -- | -- | -- | -- | -- | -- | -- | -- | -- | -- | -- | Professor Pinball | PINDUINO Sysem 11 | +5V | +5V | +5V | +5V | SIG | GND | SIG | GND | +12V | GND | +12V | GND